# EAGLE design MIDI_CV atmega max528 v2.5 (EAGLE 9.6.2)
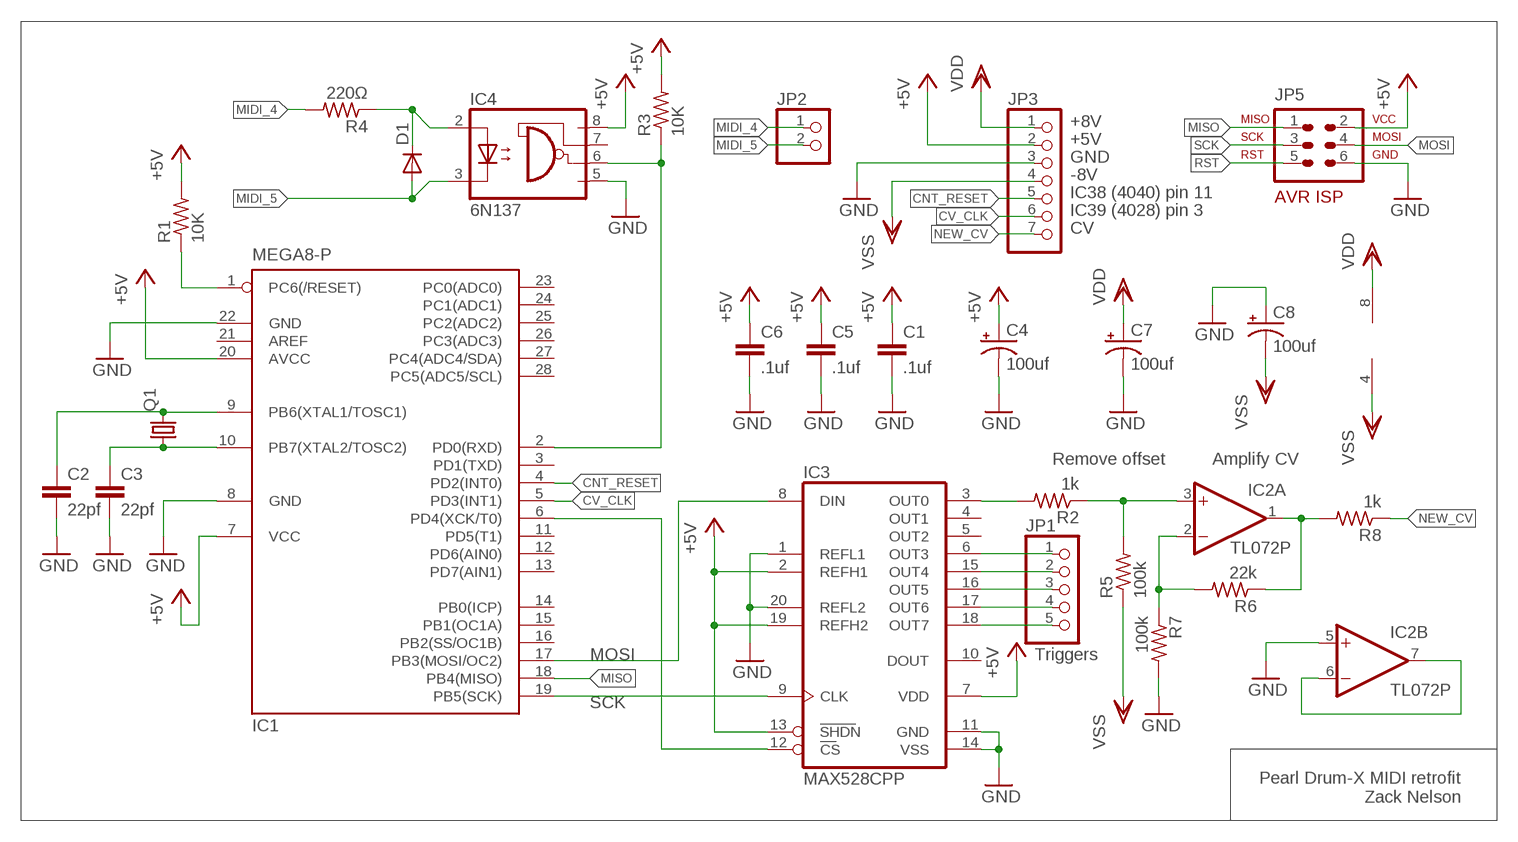
[diagram p0: schematic, sheet 1]

## Parts
C1  .1uf  C-EU025-024X044  [C025-024X044]
C2  22pf  C-EU025-024X044  [C025-024X044]
C3  22pf  C-EU025-024X044  [C025-024X044]
C4  100uf  CPOL-USE1.8-4  [E1,8-4]
C5  .1uf  C-EU025-024X044  [C025-024X044]
C6  .1uf  C-EU025-024X044  [C025-024X044]
C7  100uf  CPOL-USE1.8-4  [E1,8-4]
C8  100uf  CPOL-USE1.8-4  [E1,8-4]
D1  DIODE-D-2.5  [D-2.5]
IC1  MEGA8-P  [DIL28-3]
IC2  TL072P  [DIL08]
IC3  MAX528CPP  [DIL20]
IC4  6N137  [DIL08]
JP1  PINHD-1X5  [1X05]
JP2  PINHD-1X2  [1X02]
JP3  PINHD-1X7  [1X07]
JP5  AVR-ISP-6VERT  [AVR-ISP-6]
Q1  CRYSTALHC18U-V  [HC18U-V]
R1  10K  R-US_0204/2V  [0204V]
R2  1k  R-US_0204/2V  [0204V]
R3  10K  R-US_0204/2V  [0204V]
R4  220Ω  R-US_0204/2V  [0204V]
R5  100k  R-US_0204/2V  [0204V]
R6  22k  R-US_0204/2V  [0204V]
R7  100k  R-US_0204/2V  [0204V]
R8  1k  R-US_0204/2V  [0204V]

## Nets
+5V [power]: C1.1 C4.+ C5.1 C6.1 IC1.7(VCC) IC1.20(AVCC) IC3.2(REFH1) IC3.7(VDD) IC3.13(SHDN) IC3.19(REFH2) IC4.8(VCC) JP3.2 JP5.2 R1.2 R3.2
CNT_RESET: IC1.4(PD2(INT0)) JP3.5
CV_CLK: IC1.5(PD3(INT1)) JP3.6
GND [power]: C1.2 C2.2 C3.2 C4.- C5.2 C6.2 C7.- C8.+ IC1.8(GND) IC1.22(GND) IC2.5(B:+IN) IC3.1(REFL1) IC3.11(GND) IC3.14(VSS) IC3.20(REFL2) IC4.5(GND) JP3.3 JP5.6 R7.2
MIDI_4: JP2.1 R4.2
MIDI_5: D1.A IC4.3(C) JP2.2
MISO: IC1.18(PB4(MISO)) JP5.1
MOSI: IC1.17(PB3(MOSI/OC2)) IC3.8(DIN) JP5.4
N$2: IC2.2(A:-IN) R6.2 R7.1
N$9: IC3.6(OUT3) JP1.1
N$10: IC3.15(OUT4) JP1.2
N$11: IC1.6(PD4(XCK/T0)) IC3.12(CS)
N$12: IC3.16(OUT5) JP1.3
N$13: IC3.17(OUT6) JP1.4
N$16: D1.C IC4.2(A) R4.1
N$17: IC3.18(OUT7) JP1.5
N$18: C2.1 IC1.9(PB6(XTAL1/TOSC1)) Q1.2
N$19: IC1.2(PD0(RXD)) IC4.6(VO) R3.1
N$20: C3.1 IC1.10(PB7(XTAL2/TOSC2)) Q1.1
N$21: IC2.1(A:OUT) R6.1 R8.2
N$22: IC2.3(A:+IN) R2.1 R5.2
N$23: IC3.3(OUT0) R2.2
N$24 [power]: IC2.6(B:-IN) IC2.7(B:OUT)
NEW_CV: JP3.7 R8.1
RST: IC1.1(PC6(/RESET)) JP5.5 R1.1
SCK: IC1.19(PB5(SCK)) IC3.9(CLK) JP5.3
VDD [power]: C7.+ IC2.8(P:V+) JP3.1
VSS [power]: C8.- IC2.4(P:V-) JP3.4 R5.1
Unconnected: IC1.3(PD1(TXD)) IC1.11(PD5(T1)) IC1.12(PD6(AIN0)) IC1.13(PD7(AIN1)) IC1.14(PB0(ICP)) IC1.15(PB1(OC1A)) IC1.16(PB2(SS/OC1B)) IC1.21(AREF) IC1.23(PC0(ADC0)) IC1.24(PC1(ADC1)) IC1.25(PC2(ADC2)) IC1.26(PC3(ADC3)) IC1.27(PC4(ADC4/SDA)) IC1.28(PC5(ADC5/SCL)) IC3.4(OUT1) IC3.5(OUT2) IC3.10(DOUT) IC4.7(VE)

## Notes on the sheet
- +8V
- +5V
- GND
- -8V
- IC38 (4040) pin 11
- IC39 (4028) pin 3
- CV
- Remove offset | Amplify CV
- Triggers
- Pearl Drum-X MIDI retrofit
  Zack Nelson

## Library data of the parts
C1-C3 C5 C6 = rcl:C-EU: CAPACITOR, European symbol
C4 C7 C8 = rcl:CPOL-US: POLARIZED CAPACITOR, American symbol
D1 = diode:DIODE-: DIODE
IC1 = atmel:MEGA8-P: MICROCONTROLLER 8 Kbytes FLASH, 1 kbytes SRAM, 512 bytes EEPROM, USART, 4-channel 10 bit ADC, 2-channel 8 bit ADC Pin compatible with Atmega48, ATMega88, ATMega168 Source: avr.lbr; OC_FARNELL: unknown; OC_NEWARK: unknown
IC2 = linear:TL072: OP AMP
IC3 = maxim:MAX528CPP: DIGITAL/ANALOG CONVERTER; MPN: MAX528CPP; OC_FARNELL: 1379992; OC_NEWARK: 78C2818
IC4 = optocoupler:6N137: MOTOROLA OPTO COUPLER; MPN: 6N137; OC_FARNELL: 1328376; OC_NEWARK: 52M1895
JP1 = pinhead:PINHD-1X5: PIN HEADER
JP2 = pinhead:PINHD-1X2: PIN HEADER
JP3 = pinhead:PINHD-1X7: PIN HEADER
JP5 = avr-7:AVR-ISP-6: AVR ISP-6 Serial Programming Header
Q1 = crystal:CRYSTAL: CRYSTAL; OC_FARNELL: unknown; OC_NEWARK: unknown
R1-R8 = rcl:R-US_: RESISTOR, American symbol

## Net classes
1 power: width 0.508 mm

## Board
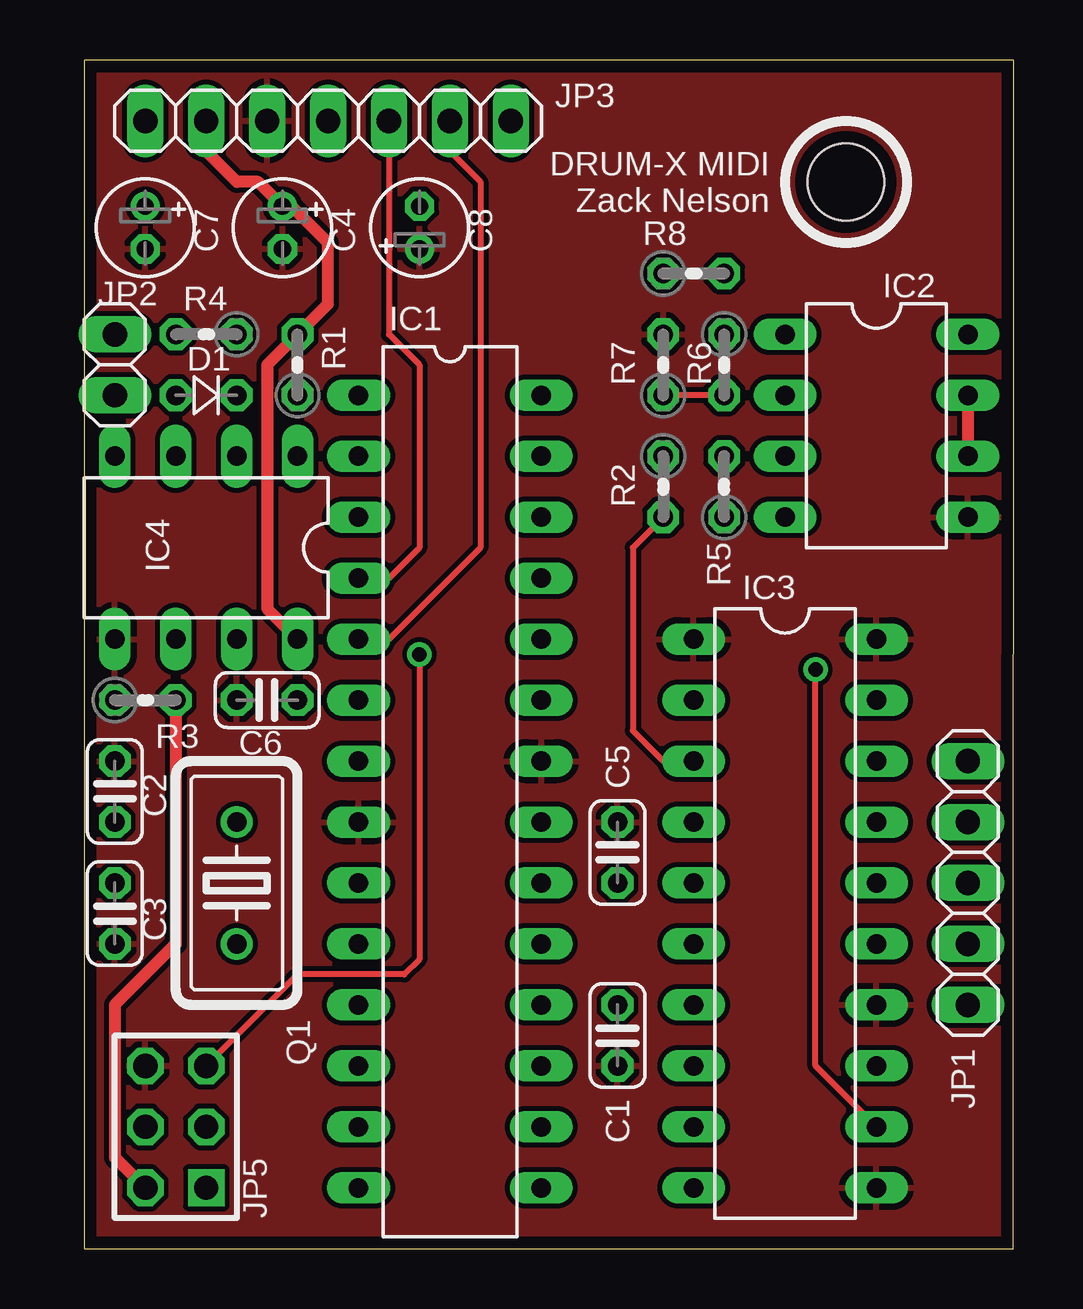
[diagram p1: board, top side]
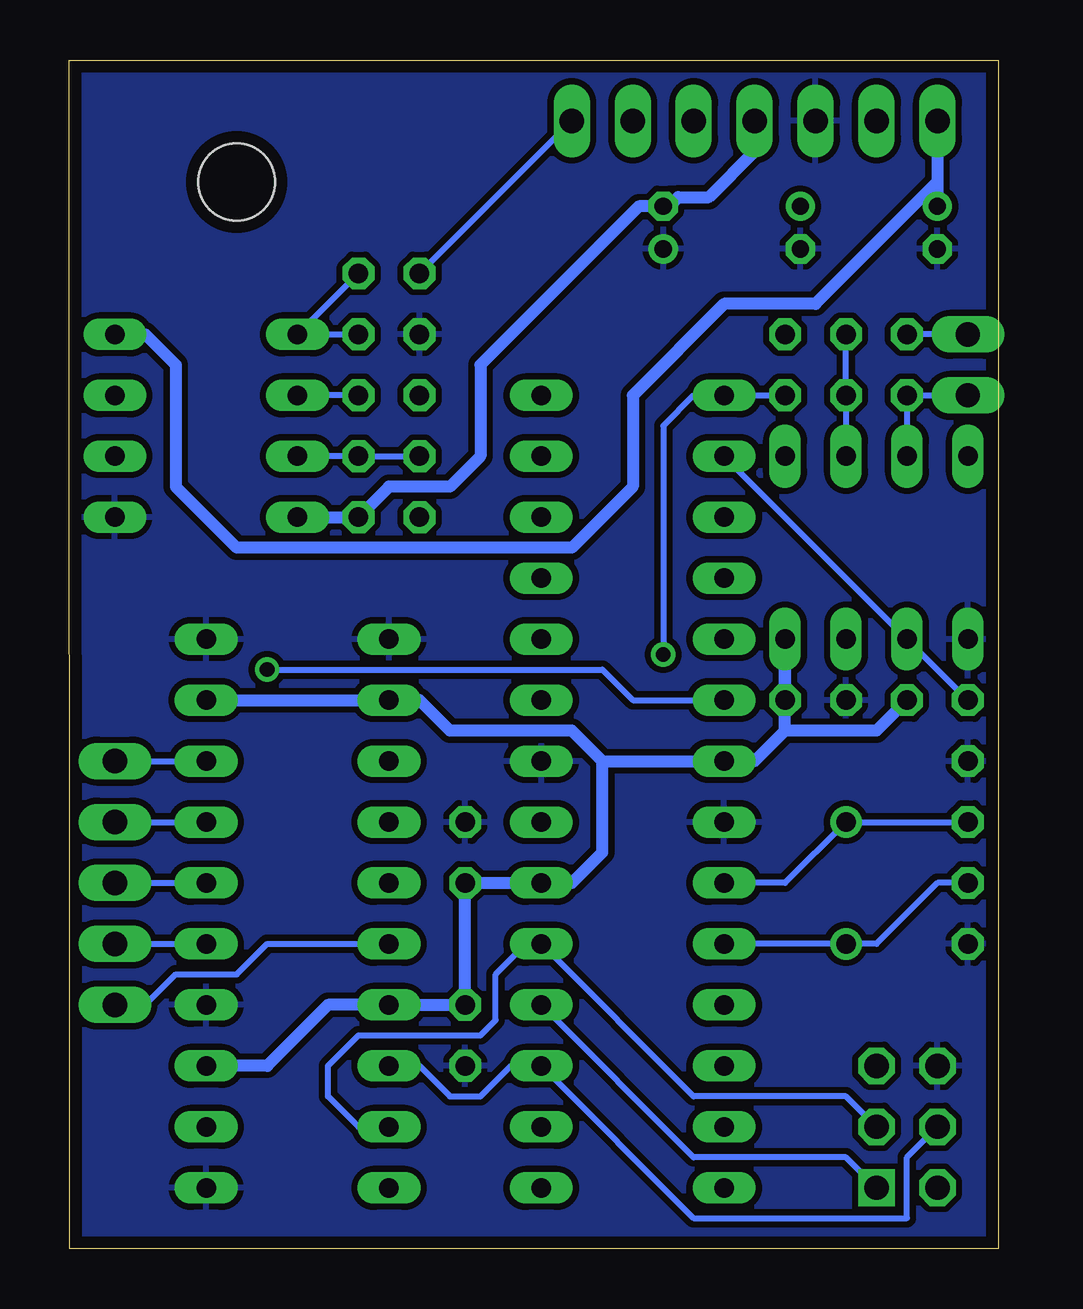
[diagram p2: board, bottom side, seen from below]

Size 38.73 x 49.53 mm. Coordinates in mm from the lower left corner, seen from the top.
Outline: 0,0 38.72,0 38.73,49.53 0,49.53 0,0
Copper layers (1*16): Top 0.035mm / dielectric 1.5mm / Bottom 0.035mm
Design rules "default *": minimum track width 10mil, minimum drill 24mil, track to track 8mil, track to pad 8mil, pad to pad 8mil, via to via 8mil, smd to smd 8mil, copper to edge 20mil, drill to drill 8mil, minimum pad ring 10mil, minimum via ring 8mil, stop-mask expansion 4mil, vias tented up to drill 0mil, thermal gap 10mil
Holes 3.2 mm at 31.75,44.45

### Footprints (pad centres in the part's own frame; a part is rotated, then mirrored left to right if it is on the bottom)
C025-024X044 = drill 0.813 octagon: 1 -1.27,0; 2 1.27,0
E1,8-4 = drill 0.711 pad 1.168: + -0.889,0 | drill 0.711 pad 1.168 octagon: - 0.889,0
D-2.5 = drill 0.813 octagon: A 1.27,0; C -1.27,0
DIL28-3 = drill 0.813 long: 1 -16.51,-3.81; 2 -13.97,-3.81; 3 -11.43,-3.81; 4 -8.89,-3.81; 5 -6.35,-3.81; 6 -3.81,-3.81; 7 -1.27,-3.81; 8 1.27,-3.81; 9 3.81,-3.81; 10 6.35,-3.81; 11 8.89,-3.81; 12 11.43,-3.81; 13 13.97,-3.81; 14 16.51,-3.81; 15 16.51,3.81; 16 13.97,3.81; 17 11.43,3.81; 18 8.89,3.81; 19 6.35,3.81; 20 3.81,3.81; 21 1.27,3.81; 22 -1.27,3.81; 23 -3.81,3.81; 24 -6.35,3.81; 25 -8.89,3.81; 26 -11.43,3.81; 27 -13.97,3.81; 28 -16.51,3.81
DIL08 = drill 0.813 pad 1.27 long: 1 -3.81,-3.81; 2 -1.27,-3.81; 3 1.27,-3.81; 4 3.81,-3.81; 5 3.81,3.81; 6 1.27,3.81; 7 -1.27,3.81; 8 -3.81,3.81
DIL20 = drill 0.813 long: 1 -11.43,-3.81; 2 -8.89,-3.81; 3 -6.35,-3.81; 4 -3.81,-3.81; 5 -1.27,-3.81; 6 1.27,-3.81; 7 3.81,-3.81; 8 6.35,-3.81; 9 8.89,-3.81; 10 11.43,-3.81; 11 11.43,3.81; 12 8.89,3.81; 13 6.35,3.81; 14 3.81,3.81; 15 1.27,3.81; 16 -1.27,3.81; 17 -3.81,3.81; 18 -6.35,3.81; 19 -8.89,3.81; 20 -11.43,3.81
DIL08' = drill 0.813 long: 1 -3.81,-3.81; 2 -1.27,-3.81; 3 1.27,-3.81; 4 3.81,-3.81; 5 3.81,3.81; 6 1.27,3.81; 7 -1.27,3.81; 8 -3.81,3.81
1X05 = drill 1.016 long: 1 -5.08,0; 2 -2.54,0; 3 0,0; 4 2.54,0; 5 5.08,0
1X02 = drill 1.016 long: 1 -1.27,0; 2 1.27,0
1X07 = drill 1.016 long: 1 -7.62,0; 2 -5.08,0; 3 -2.54,0; 4 0,0; 5 2.54,0; 6 5.08,0; 7 7.62,0
AVR-ISP-6 = drill 1.016 square: 1 -2.54,-1.27 | drill 1.016 octagon: 2 -2.54,1.27; 3 0,-1.27; 4 0,1.27; 5 2.54,-1.27; 6 2.54,1.27
HC18U-V = drill 0.813: 1 -2.54,0; 2 2.54,0
0204V = drill 0.813 octagon: 1 -1.27,0; 2 1.27,0

### Placement (x,y rotation side)
C1  22.23,8.89 270 top
C2  1.27,19.05 90 top
C3  1.27,13.97 270 top
C4  8.26,42.55 270 top
C5  22.23,16.51 90 top
C6  7.62,22.86 180 top
C7  2.54,42.55 270 top
C8  13.97,42.55 90 top
D1  5.08,35.56 180 top
IC1  15.24,19.05 270 top
IC2  33.02,34.29 270 top
IC3  29.21,13.97 270 top
IC4  6N137  [DIL08']  5.08,29.21 180 top
JP1  36.83,15.24 90 top
JP2  1.27,36.83 270 top
JP3  10.16,46.99 0 top
JP5  3.81,5.08 90 top
Q1  6.35,15.24 90 top
R1  8.89,36.83 90 top
R2  24.13,31.75 270 top
R3  2.54,22.86 0 top
R4  5.08,38.1 180 top
R5  26.67,31.75 90 top
R6  26.67,36.83 270 top
R7  24.13,36.83 90 top
R8  25.4,40.64 0 top

### Tracks (layer width: path | path; a pad name or v marks a point on that pad's centre or on a via)
+5V
  Top 0.508: JP3.2 5.08,45.72 6.35,44.45 7.24,44.45 C4.+ 8.64,43.43 10.16,41.91 10.16,39.37 R1.2 7.62,36.83 7.62,26.67 IC4.8 | JP5.2 1.27,3.81 1.27,10.16 3.81,12.7 R3.2
  Bottom 0.508: IC3.19 IC3.2 24.13,22.86 22.86,21.59 17.78,21.59 16.51,20.32 | IC3.13 30.48,7.62 27.94,10.16 IC3.7 C1.1 C5.1 IC1.20 17.78,15.24 16.51,16.51 16.51,20.32 | 8.89,21.59 10.16,20.32 IC1.7 16.51,20.32 | R3.2 5.08,21.59 8.89,21.59 | 8.89,21.59 IC4.8 C6.1
CNT_RESET
  Top 0.254: IC1.4 12.7,27.94 13.97,29.21 13.97,36.83 12.7,38.1 JP3.5
CV_CLK
  Top 0.254: IC1.5 12.7,25.4 16.51,29.21 16.51,44.45 15.24,45.72 JP3.6
GND
  pour Bottom (isolate 0.254): 0,0 38.73,0 38.73,49.53 0,49.53
  pour Top: 0,0 38.73,0 38.73,49.53 0,49.53
MIDI_4
  Bottom 0.254: JP2.1 R4.2
MIDI_5
  Bottom 0.254: IC4.3 D1.A JP2.2
MISO
  Bottom 0.254: JP5.1 6.35,3.81 12.7,3.81 IC1.18
MOSI
  Bottom 0.254: IC3.8 24.13,7.62 22.86,6.35 21.59,6.35 20.32,7.62 IC1.17 12.7,1.27 3.81,1.27 3.81,3.81 JP5.4
N$2
  Top 0.254: R6.2 R7.1
  Bottom 0.254: R6.2 IC2.2
N$9
  Bottom 0.254: IC3.6 30.48,12.7 31.75,11.43 34.29,11.43 35.56,10.16 JP1.1
N$10
  Bottom 0.254: JP1.2 IC3.15
N$11  (via drill 0.61)
  Top 0.254: v30.48,24.13 30.48,7.62 IC3.12
  Bottom 0.254: IC1.6 15.24,22.86 16.51,24.13 v30.48,24.13
N$12
  Bottom 0.254: JP1.3 IC3.16
N$13
  Bottom 0.254: JP1.4 IC3.17
N$16
  Bottom 0.254: IC4.2 D1.C R4.1
N$17
  Bottom 0.254: JP1.5 IC3.18
N$18
  Bottom 0.254: C2.1 Q1.2 8.89,15.24 IC1.9
N$19
  Bottom 0.254: R3.1 IC4.6 IC1.2
N$20
  Bottom 0.254: C3.1 2.54,15.24 5.08,12.7 Q1.1 IC1.10
N$21
  Bottom 0.254: R6.1 IC2.1 R8.2
N$22
  Bottom 0.254: R2.1 R5.2 IC2.3
N$23
  Top 0.254: IC3.3 24.13,20.32 22.86,21.59 22.86,29.21 R2.2
N$24
  Top 0.508: IC2.7 IC2.6
NEW_CV
  Bottom 0.254: JP3.7 R8.1
RST  (via drill 0.61)
  Top 0.254: JP5.5 8.89,11.43 13.34,11.43 13.97,12.06 v13.97,24.77
  Bottom 0.254: R1.1 IC1.1 12.7,35.56 13.97,34.29 v13.97,24.77
SCK
  Bottom 0.254: JP5.3 6.35,6.35 12.7,6.35 IC1.19 19.68,12.7 20.95,11.43 20.95,9.53 21.59,8.89 26.67,8.89 27.94,7.62 27.94,6.35 26.67,5.08 IC3.9
VDD
  Bottom 0.508: JP3.1 2.54,44.45 | IC2.8 35.56,38.1 34.29,36.83 34.29,31.75 31.75,29.21 17.78,29.21 15.24,31.75 15.24,35.56 11.43,39.37 7.62,39.37 2.54,44.45 | 2.54,44.45 C7.+
VSS
  Bottom 0.508: IC2.4 R5.1 25.4,31.75 22.86,31.75 21.59,33.02 21.59,36.83 14.99,43.43 C8.- 13.97,43.18 13.34,43.81 12.06,43.81 10.16,45.72 JP3.4

### Text on the board
tNames: DRUM-X MIDI / Zack Nelson
tDocu: +8V | +5V | GND | -8V | IC38 (4040) pin 11 | IC39 (4028) pin 3 | CV | MIDI pin 4 | MIDI pin 5 | Triggers